# Altium schematic sheet Keyfinder_RF.SchDoc: Keyfinder nRF24L01+
size A4; DrawnBy: M. Schwegler; Organization: HSLU T&A; Address1: Abteilung Elektrotechnik; Address2: Technikumsstrasse 21; Address3: CH-6048 Horw; Revision: v2; SheetNumber: 3; SheetTotal: 4; Projektname: SmartBoard
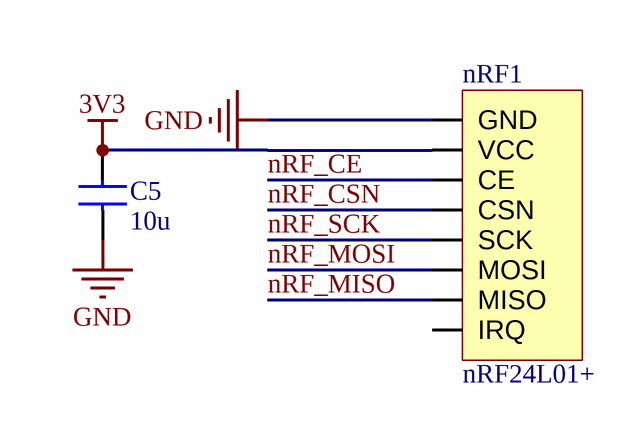
[diagram p0: Keyfinder_RF.SchDoc]

## Parts
C5  10u  [0805_C]
nRF1  nRF24L01+  [CON_THT_2x4P_RM2.54_Stiftl]

## Nets
3V3: C5.2 nRF1.2(VCC)
GND: C5.1 nRF1.1(GND)
nRF_CE: nRF1.3(CE)
nRF_CSN: nRF1.4(CSN)
nRF_MISO: nRF1.7(MISO)
nRF_MOSI: nRF1.6(MOSI)
nRF_SCK: nRF1.5(SCK)

Not connected (* = marked no-connect by the designer): nRF1 8(IRQ)

## Notes on the sheet
- Project:
- Drawn by:
- Size:
- Sheet
- A4
- Rev.:
- of
- Date:
- File:

## Library data of the parts
C5 = C?: Normaler Kondensator
nRF1 = Bluefruit